# EAGLE schematic edp_to_DP (EAGLE 9.4.2)
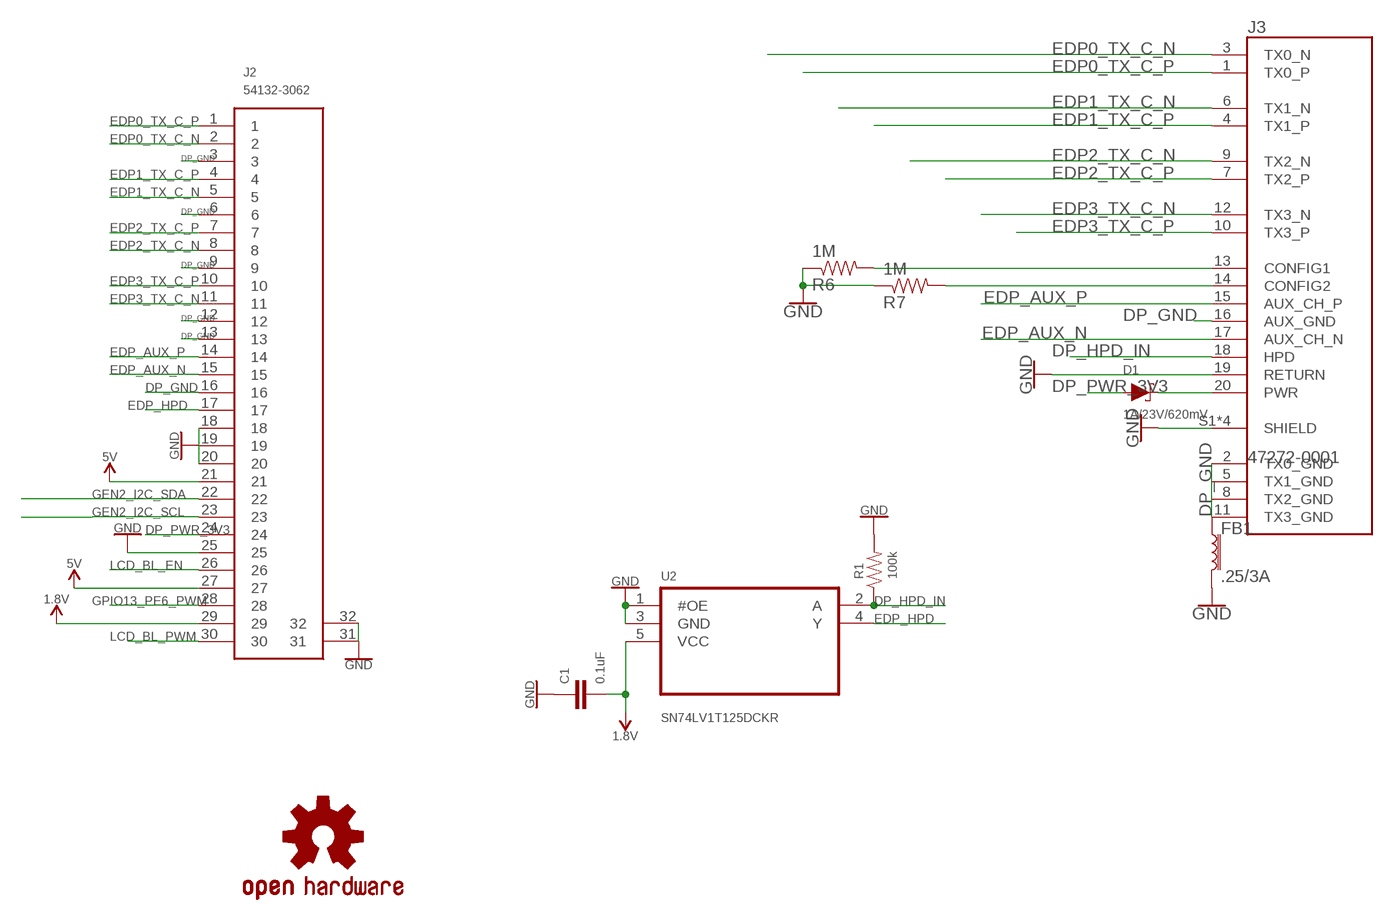
[diagram p0: schematic, sheet 1]

## Parts
C1  0.1uF  10NF-0603-50V-10%  [0603]
D1  1A/23V/620mV  DIODE-SCHOTTKY-BAT20J  [SOD-323]
FB1  .25/3A  FERRITE_BEAD-0603  [0603]
J2  54132-3062  [54132-3062]
J3  47272-0001  [MOLEX_47272-0001]
LOGO1  OSHW-LOGOS-COPPER  [OSHW-LOGO-S_COPPER]
R1  100k  RESISTOR0805-RES  [0805]
R6  1M  RESISTOR0805-RES  [0805]
R7  1M  RESISTOR0805-RES  [0805]
U2  SN74LV1T125DCKR  [SOT65P210X110-5N]

## Nets
1.8V: C1.2 J2.29 U2.5(VCC)
3V3: D1.C J3.20(PWR)
5V: J2.21 J2.27
CONFIG3: J3.13(CONFIG1) R6.2
CONFIG4: J3.14(CONFIG2) R7.2
DP_GND: FB1.1 J2.3 J2.6 J2.9 J2.12 J2.13 J2.16 J3.2(TX0_GND) J3.5(TX1_GND) J3.8(TX2_GND) J3.11(TX3_GND) J3.16(AUX_GND)
DP_HPD_IN: J3.18(HPD) R1.1 U2.2(A)
DP_PWR_3V3: D1.A J2.24
EDP0_TX_C_N: J2.2 J3.3(TX0_N)
EDP0_TX_C_P: J2.1 J3.1(TX0_P)
EDP1_TX_C_N: J2.5 J3.6(TX1_N)
EDP1_TX_C_P: J2.4 J3.4(TX1_P)
EDP2_TX_C_N: J2.8 J3.9(TX2_N)
EDP2_TX_C_P: J2.7 J3.7(TX2_P)
EDP3_TX_C_N: J2.11 J3.12(TX3_N)
EDP3_TX_C_P: J2.10 J3.10(TX3_P)
EDP_AUX_N: J2.15 J3.17(AUX_CH_N)
EDP_AUX_P: J2.14 J3.15(AUX_CH_P)
EDP_HPD: J2.17 U2.4(Y)
GEN2_I2C_SCL: J2.23
GEN2_I2C_SDA: J2.22
GND: C1.1 FB1.2 J2.18 J2.19 J2.20 J2.25 J2.31 J2.32 J3.19(RETURN) J3.S1(SHIELD) J3.S2(SHIELD) J3.S3(SHIELD) J3.S4(SHIELD) R1.2 R6.1 R7.1 U2.1(#OE) U2.3(GND)
GPIO13_PE6_PWM: J2.28
LCD_BL_EN: J2.26
LCD_BL_PWM: J2.30

## Library data of the parts
C1 = SparkFun-Capacitors:10NF: 0.01uF/10nF/10,000pF ceramic capacitors A capacitor is a passive two-terminal electrical component used to store electrical energy temporarily in an electric field. CAP-09321; PROD_ID: CAP-00867; VALUE: 10nF
D1 = SparkFun-DiscreteSemi:DIODE-SCHOTTKY: Schottky diode A Schottky diode is a semiconductor diode which has a low forward voltage drop and a very fast switching action.; PROD_ID: DIO-11623
FB1 = SparkFun-Coils:FERRITE_BEAD: Ferrite Bead (blocks, cores, rings, chokes, etc.) Inductor with layers of ferrite used to suppress high frequencies. Often used to isolate high frequency noise. SparkFun Products: IOIO-OTG - V2.2 <https://www.sparkfun.com/products/13613> SparkFun SAMD21 Mini Breakout <https://www.sparkfun.com/products/13664> SparkFun 6 Degrees of Freedom Breakout - LSM6DS3 <https://www.sparkfun.com/products/13339> SparkFun SAMD21 Dev Breakout <https://www.sparkfun.com/products/13672>; PROD_ID: NDUC-13805; VALUE: 30Ω/1.8A
J2 = 54132-3062:54132-3062: Connector 0.5mm, FFC/FPC, SMT,r/a,30w,Au Molex FFC/FPC SMT Series 0.5mm Pitch 30 Way Right Angle SMT Female FPC Connector, ZIF Bottom Contact Source: Datasheet <https://componentsearchengine.com/Datasheets/1/54132-3062.pdf>; DESCRIPTION: Connector 0.5mm, FFC/FPC, SMT,r/a,30w,Au Molex FFC/FPC SMT Series 0.5mm Pitch 30 Way Right Angle SMT Female FPC Connector, ZIF Bottom Contact; HEIGHT: mm; MANUFACTURER_NAME: Molex; MANUFACTURER_PART_NUMBER: 54132-3062; MOUSER_PART_NUMBER: 538-54132-3062; MOUSER_PRICE-STOCK: https://www.mouser.com/Search/Refine.aspx?Keyword=538-54132-3062
J3 = 47272-0001:47272-0001: Conn Display Port RCP 20 POS 0.5mm Solder RA SMD 20 Terminal 1 Port DisplayPort T/R; AVAILABILITY: Unavailable; DESCRIPTION: Conn Display Port RCP 20 POS 0.5mm Solder RA SMD 20 Terminal 1 Port DisplayPort T/R; MF: Molex; MP: 47272-0001; PACKAGE: None; PRICE: None
LOGO1 = SparkFun-Aesthetics:OSHW-LOGO: Open-Source Hardware (OSHW) Logo This logo indicates the piece of hardware it is found on incorporates a OSHW license and/or adheres to the definition of open source hardware found here: http://freedomdefined.org/OSHW
R1 R6 R7 = SparkFun-Passives:RESISTOR: Resistor Basic schematic elements and footprints for 0603, 1206, and PTH resistors.
U2 = SN74LV1T125DCKR:SN74LV1T125DCKR: None; AVAILABILITY: Unavailable; DESCRIPTION: Single Power Supply, Single BUFFER GATE w/ 3-State Output _active low enable_ 5-SC70 -40 to 125; MF: Texas Instruments; MP: SN74LV1T125DCKR; PACKAGE: SC-70-5 Texas Instruments; PRICE: None